# EAGLE design os33_master (EAGLE 9.6.2)
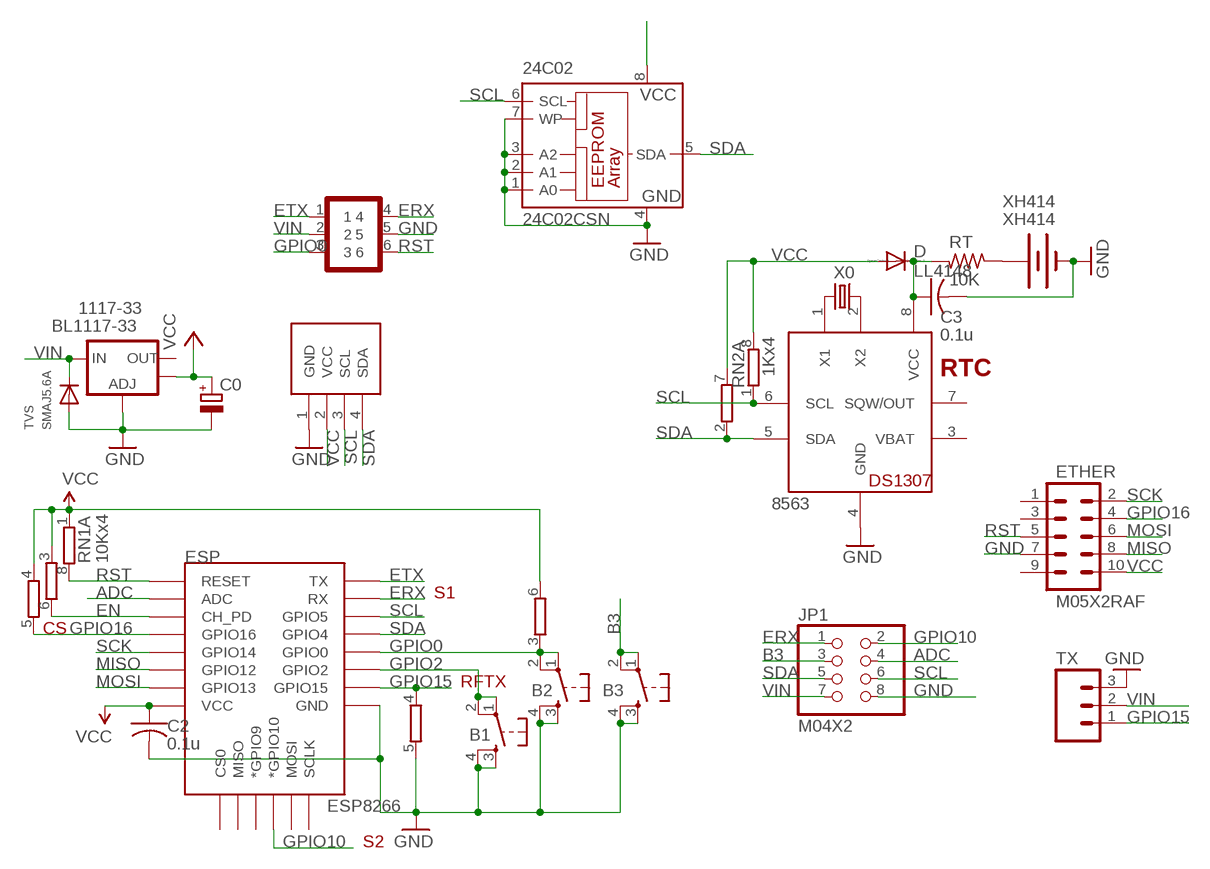
[diagram p0: schematic, sheet 1]

## Parts
24C02  24C02CSN  [SO-08]
1117-33  BL1117-33  V_REG_LM1117SOT223  [SOT223]
8563  PCF8563  DS1307SOIC  [SO08]
B1  SPST_TACTEVQQ2  [EVQ-Q2]
B2  SPST_TACTEVQQ2  [EVQ-Q2]
B3  SPST_TACTEVQQ2  [EVQ-Q2]
C0  CPOL-EUC  [PANASONIC_C]
C2  0.1u  C-USC0603  [C0603]
C3  0.1u  C-USC0603  [C0603]
D  LL4148  DIODE-MINIMELF  [MINIMELF]
ESP  ESP8266  ESP12ESMD  [ESP12E-SMD]
ETHER  M05X2RAF  [2X5-RAF]
JP1  M04X2  PINHD-2X4  [2X04]
LCD  SSD1306_OLED_I2CPCB0.75BB  [SSD1306_OLED_I2C_PCB_0.75BB]
RN1  10Kx4  4R-NEXB38V  [EXB38V]
RN2  1Kx4  4R-NEXB38V  [EXB38V]
RT  10K  R-US_R0603  [R0603]
TVS  SMAJ5.6A  DIODESMA  [SMADIODE]
TX  M03LOCK  [1X03_LOCK]
U$3  GOLDFINGER_2X3  [GOLDFINGER_2X3]
X0  32.768kHz  CRYSTALTC26H  [TC26H]
XH414  XH414  BATTERYXH414  [BATTCON_XH414]

## Nets
ADC [adc]: ESP.ADC JP1.4
B3: B3.1 B3.2 JP1.3
EN: ESP.CH_PD RN1.6
ERX: ESP.RXD0(RX) JP1.1 U$3.4
ETX: ESP.TXD0(TX) U$3.1
GND: 24C02.1(A0) 24C02.2(A1) 24C02.3(A2) 24C02.4(GND) 24C02.7(WP) 1117-33.1(ADJ) 8563.4(GND) B1.3 B1.4 B2.3 B2.4 B3.3 B3.4 C0.- C2.2 C3.2 ESP.GND ETHER.7 JP1.8 LCD.1(GND) RN2.5 TVS.A TX.3 U$3.5 XH414.P$1(-)
GPIO0: B2.1 B2.2 ESP.GPIO0 RN2.3 U$3.3
GPIO2: B1.1 B1.2 ESP.GPIO2
GPIO10: ESP.GPIO10(*GPIO10) JP1.2
GPIO15: ESP.GPIO15 RN2.4 TX.1
GPIO16: ESP.GPIO16 ETHER.4 RN1.5
MISO: ESP.GPIO12 ETHER.8
MOSI: ESP.GPIO13 ETHER.6
N$1: 8563.1(X1) X0.2
N$2: 8563.2(X2) X0.1
N$11: 8563.8(VCC) C3.1 D.C RT.2
N$36: RT.1 XH414.P$2(+)
RST: ESP.RESET ETHER.5 RN1.8 U$3.6
SCK: ESP.GPIO14 ETHER.2
SCL [I2C]: 24C02.6(SCL) 8563.6(SCL) ESP.GPIO5 JP1.6 LCD.3(SCL) RN2.1
SDA [I2C]: 24C02.5(SDA) 8563.5(SDA) ESP.GPIO4 JP1.5 LCD.4(SDA) RN2.2
VCC [vcc]: 24C02.8(VCC) 1117-33.4(OUT) C0.+ C2.1 D.A ESP.VCC ETHER.10 LCD.2(VCC) RN1.1 RN1.3 RN1.4 RN2.6 RN2.7 RN2.8
VIN [power]: 1117-33.3(IN) JP1.7 TVS.C TX.2 U$3.2
Unconnected: 1117-33.2(OUT) 8563.7(SQW/OUT) ESP.CS0 ESP.GPIO9(*GPIO9) ESP.MISO ESP.MOSI ESP.SCLK ETHER.1 ETHER.3 ETHER.9 RN1.2 RN1.7

## Notes on the sheet
- RTC
- S1
- CS
- RFTX
- S2

## Power pins joined to a net without a drawn wire
VBAT: 8563.3(VBAT)

## Library data of the parts
24C02 = microchip:24C*: Serial EEPROM 1 K/2 K/4 K; MF: MICROCHIP; MPN: 24C02C/SN; OC_FARNELL: 1607552; OC_NEWARK: 96K4065
1117-33 = SparkFun:V_REG_LM1117: Voltage Regulator LM1117 Standard adjustable voltage regulator but in SMD form. Spark Fun Electronics SKU : COM-00595
8563 = adafruit:DS1307: DS1307 Real time clock (RTC) with battery backup ability. Talk to it via i2c
B1-B3 = adafruit_3:SPST_TACT: SMT 6mm switch, EVQQ2 series http://www.ladyada.net/library/eagle
C0 = rcl:CPOL-EU: POLARIZED CAPACITOR, European symbol
C2 C3 = adafruit:C-US: CAPACITOR, American symbol
D = diode:DIODE-: DIODE
ESP = esp8266modules:ESP12E: ESP12E Module
ETHER = SparkFunNew:M05X2: Header 5x2 Standard 10-pin dual row 0.1" header. Commonly used with AVR-ISP. Use with Spark Fun Electronics SKU: PRT-00778
JP1 = pinhead:PINHD-2X4: PIN HEADER
LCD = adafruit2013:SSD1306_OLED_I2C
RN1 RN2 = resistor-dil:4R-N: Array Chip Resistor Source: RS Component / Phycomp; OC_FARNELL: unknown; OC_NEWARK: unknown
RT = adafruitGood:R-US_: RESISTOR, American symbol
TVS = adafruit:DIODE: Diode SMADIODE - SMA Surface Mount Package 20V 1A Schottky Diode Digikey: 641-1014-6-ND DO-1N4148 - Through Hole Small Current Diode SOD-123 20V 1 A (.5mV Vf) Schottky Diode - Digikey: MBRX120TPMSCT-ND SOD-323 10V 570mA (.38mV Vf, 3ns) Schottky Diode - Digikey: ZLLS410CT-ND SOD-523 30V 30mA Schottky Diode (RB751S-40TE61) - Digikey: RB751S-40TE61CT-ND SOT23-R/W - SOT23 Package (R = Solder Paste/Reflow Ovens, W = Hand-Soldering) BAT54Film 40V 300mA - Digikey: 497-7162-1-ND
TX = SparkFun:M03: Header 3 Standard 3-pin 0.1" header. Use with straight break away headers (SKU : PRT-00116), right angle break away headers (PRT-00553), swiss pins (PRT-00743), machine pins (PRT-00117), and female headers (PRT-00115). Molex polarized connector foot print use with SKU : PRT-08232 with associated crimp pins and housings.
U$3 = SparkFunNew:GOLDFINGER_2X3
X0 = crystal:CRYSTAL: CRYSTAL; OC_FARNELL: unknown; OC_NEWARK: unknown
XH414 = SparkFunNew:BATTERY: Battery Holders Various common sizes : AA, AAA, 20mm coin cell and 12mm coin cell.

## Net classes
0 default: width 0.254 mm, clearance 0.203 mm
1 power: width 0.406 mm, clearance 0.203 mm
2 relaypower: width 0.254 mm, clearance 0.203 mm
3 signal: width 0.254 mm, clearance 0.203 mm
4 adc: width 0.406 mm, clearance 0.203 mm
5 vcc: width 0.305 mm, clearance 0.203 mm
6 I2C: width 0.254 mm, clearance 0.203 mm

## Board
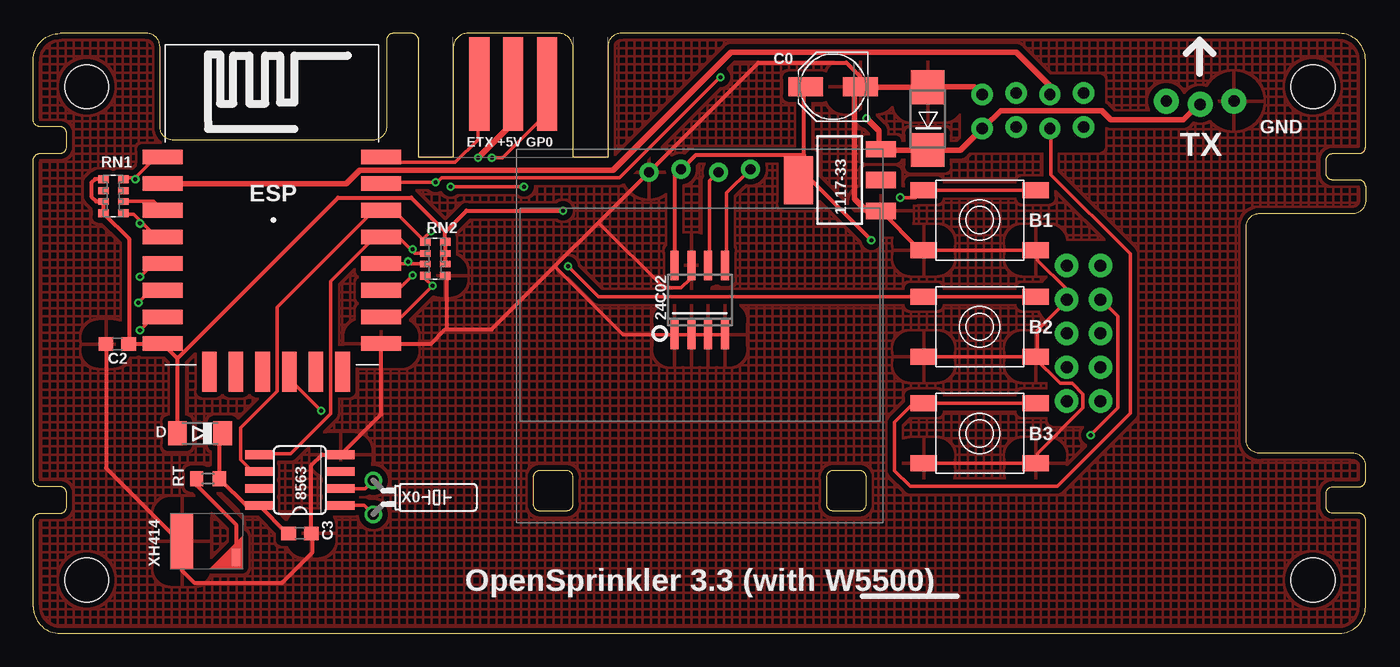
[diagram p1: board, top side]
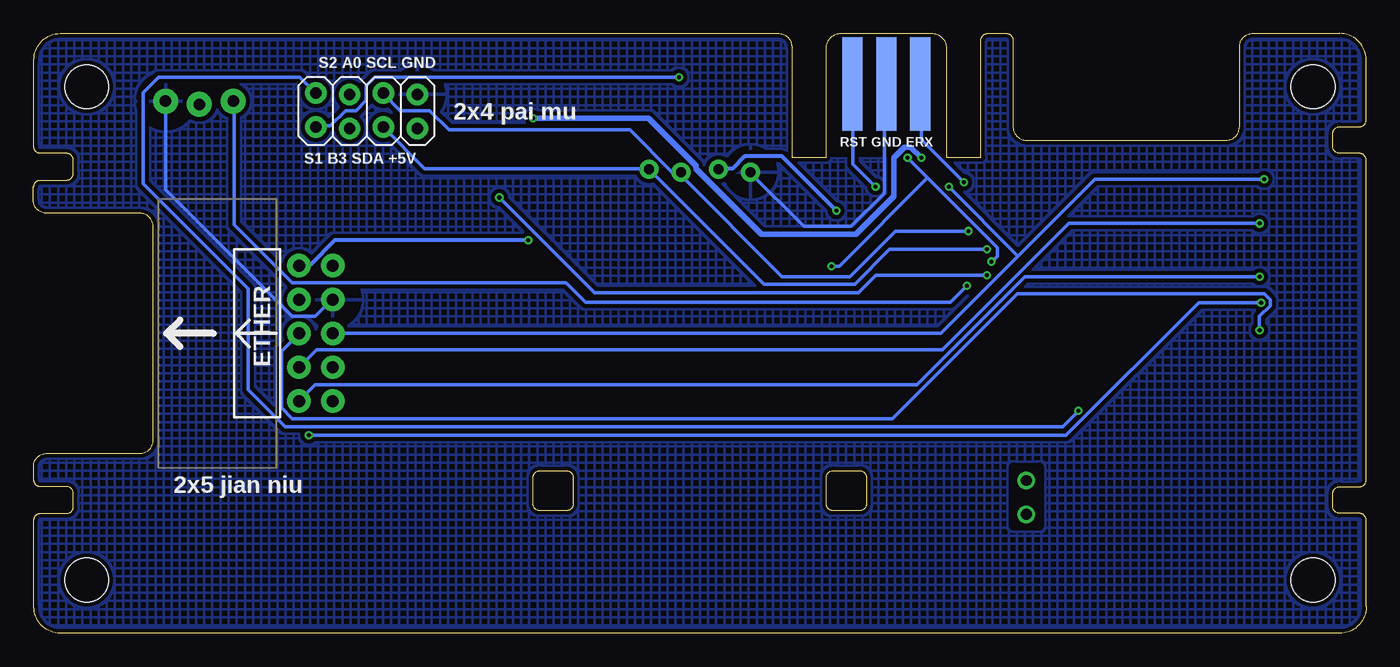
[diagram p2: board, bottom side, seen from below]

Size 100 x 45 mm. Coordinates in mm from the lower left corner, seen from the top.
Outline: 2,0 98,0 arc90 99.95,2 99.95,8.5 arc90 99.5,9 97.5,9 arc-90 97,9.5 97,10.5 arc-90 97.5,11 99.5,11 arc90 99.95,11.5 99.99,12.49 arc91 98.99,13.5 92,13.5 arc-90 91,14.5 91,30.5 arc-90 92,31.5 99,31.5 arc90 100,32.5 100,33.5 99.95,33.5 arc90 99.5,34 97.5,34 arc-90 97,34.5 97,35.5 arc-90 97.5,36 99.5,36 arc90 99.95,36.5 99.95,43 arc90 98,45 44.1,45 arc90 43.1,44 43.1,35.7 40.5,35.7 40.5,44 arc90 39.3,45 32.7,45 arc90 31.5,44 31.5,35.7 28.9,35.7 28.9,44.5 arc90 28.4,45 27,45 arc90 26.5,44.5 26.5,38 arc-90 25.5,37 10.5,37 arc-90 9.5,38 9.5,44 arc90 8.5,45 2,45 arc90 0,43 0,38.5 arc90 0.5,38 2,38 arc-90 2.5,37.5 2.5,36.5 arc-90 2,36 0.5,36 arc90 0,35.5 0,11.5 arc90 0.5,11 2,11 arc-90 2.5,10.5 2.5,9.5 arc-90 2,9 0.5,9 arc90 0,8.5 0,2 arc90 2,0
Copper layers (1*16): Top 0.035mm / dielectric 1.5mm / Bottom 0.035mm
Design rules "Fusion_eagle_rule_v1.1 *": minimum track width 6mil, minimum drill 12mil, track to track 6mil, track to pad 6mil, pad to pad 6mil, via to via 6mil, smd to smd 0mil, copper to edge 10mil, drill to drill 10mil, minimum pad ring 10mil, minimum via ring 6mil, stop-mask expansion 2mil, vias tented up to drill 100mil, thermal gap 50mil
Holes 3.3 mm at 4,4 96,4 4,41 96,41
tRestrict: area 70,36.5 to 80,41.5; area 31.5,36 to 40.5,45; area 76.5,16 to 81,29
bRestrict: area 24.5,8 to 26.5,12.5; area 31.5,36 to 40.5,45
vRestrict: area 11,20.5 to 25,36.5

### Footprints (pad centres in the part's own frame; a part is rotated, then mirrored left to right if it is on the bottom)
SO-08 = smd 0.6 x 2.2: 1 -1.905,-2.6; 2 -0.635,-2.6; 3 0.635,-2.6; 4 1.905,-2.6; 5 1.905,2.6; 6 0.635,2.6; 7 -0.635,2.6; 8 -1.905,2.6
SOT223 = smd 1.219 x 2.235: 1 -2.311,-3.099; 2 0,-3.099; 3 2.311,-3.099 | smd 3.6 x 2.2: 4 0,3.099
SO08 = smd 0.66 x 2.032: 1 -1.905,-3.073; 2 -0.635,-3.073; 3 0.635,-3.073; 4 1.905,-3.073; 5 1.905,3.073; 6 0.635,3.073; 7 -0.635,3.073; 8 -1.905,3.073
EVQ-Q2 = smd 2 x 1.2: 1 -4.2,-2.25; 2 4.2,-2.25; 3 -4.2,2.25; 4 4.2,2.25
PANASONIC_C = smd 2.6 x 1.4: + 2.05,0; - -2.05,0
C0603 = smd 1.1 x 1: 1 -0.85,0; 2 0.85,0
MINIMELF = smd 1.4 x 1.8: A 1.7,0; C -1.7,0
ESP12E-SMD = smd 3 x 1.1: ADC -8.3,2.73; CH_PD -8.3,0.73; GND 8.1,-9.27; GPIO0 8.1,-3.27; GPIO2 8.1,-5.27; GPIO4 8.1,-1.27; GPIO5 8.1,0.73; GPIO12 -8.3,-5.27; GPIO13 -8.3,-7.27; GPIO14 -8.3,-3.27; GPIO15 8.1,-7.27; GPIO16 -8.3,-1.27; RESET -8.3,4.73; RXD0 8.1,2.73; TXD0 8.1,4.73; VCC -8.3,-9.27 | smd 1.1 x 3: CS0 -4.8,-11.37; GPIO9 -0.8,-11.37; GPIO10 1.2,-11.37; MISO -2.8,-11.37; MOSI 3.2,-11.37; SCLK 5.2,-11.37
2X5-RAF = drill 0.9 pad 1.75: 1 5.08,1.27; 2 5.08,-1.27; 3 2.54,1.27; 4 2.54,-1.27; 5 0,1.27; 6 0,-1.27; 7 -2.54,1.27; 8 -2.54,-1.27; 9 -5.08,1.27; 10 -5.08,-1.27
2X04 = drill 0.85 pad 1.6: 1 -3.81,-1.219; 2 -3.81,1.321; 3 -1.27,-1.321; 4 -1.27,1.219; 5 1.27,-1.219; 6 1.27,1.321; 7 3.81,-1.321; 8 3.81,1.219
SSD1306_OLED_I2C_PCB_0.75BB = drill 0.75 pad 1.422: 1 -3.81,-0.1; 2 -1.42,0.1; 3 1.42,-0.1; 4 3.81,0.1
EXB38V = smd 0.6 x 0.8: 1 -1.275,-0.75; 4 1.275,-0.75; 5 1.275,0.75; 8 -1.275,0.75 | smd 0.5 x 0.8: 2 -0.4,-0.75; 3 0.4,-0.75; 6 0.4,0.75; 7 -0.4,0.75
R0603 = smd 1 x 1.1: 1 -0.85,0; 2 0.85,0
SMADIODE = smd 2.54 x 2.54: A 2.349,0; C -2.349,0
1X03_LOCK = drill 0.85 pad 1.88: 1 0,0.127; 2 2.54,-0.127; 3 5.08,0.127
GOLDFINGER_2X3 = smd 1.524 x 7: 1 -2.54,-3.5; 2 0,-3.5; 3 2.54,-3.5 | smd 1.524 x 7 bottom: 4 -2.54,-3.5; 5 0,-3.5; 6 2.54,-3.5
TC26H = drill 0.813: 1 -1.27,0; 2 1.27,0
BATTCON_XH414 = smd 4.1 x 1.7: P$1 0,-1.85 | smd 1.27 x 0.635: P$2 1.2,2.2

### Placement (x,y rotation side)
24C02  50,25 0 top
1117-33  60.5,34 90 top
8563  20,11.5 90 top
B1  71,31 180 top
B2  71,23 180 top
B3  71,15 180 top
C0  60,41 180 top
C2  6.3,21.7 180 top
C3  20,7.5 0 top
D  12.5,15 180 top
ESP  18,31 0 top
ETHER  78.8,22.5 270 bottom
JP1  75,39.2 0 bottom
LCD  50,34.7 0 top
RN1  6,32.8 270 top
RN2  30.15,28.1 270 top
RT  13.1,11.6 0 top
TVS  67.1,38.6 90 top
TX  85,39.8 0 top
U$3  36,44.7 0 top
X0  25.5,10.2 270 top
XH414  13,6.9 270 top

### Tracks (layer width: path | path; a pad name or v marks a point on that pad's centre or on a via)
ADC
  Top 0.406: ESP.ADC 23.48,33.73 24.48,34.74 43.48,34.74 52.35,43.6 73.74,43.6 76.27,41.07 JP1.4
B3
  Top 0.254: B3.1 B3.2 66.04,17.25 64.61,15.82 64.61,12.2 65.79,11.02 76.82,11.02 82.29,16.5 82.29,28.47 76.35,34.4 76.35,37.83 JP1.3
EN
  Top 0.254: RN1.6 9.03,32.4 ESP.CH_PD
ERX  (via drill 0.3)
  Top 0.254: ESP.RXD0 26.18,33.83 v30.18,33.83 30.29,33.83 30.63,34.18 43.98,34.18 51.52,41.72 v51.55,41.72
  Bottom 0.254: v30.18,33.83 33.38,37.03 33.38,41.15 U$3.4 | v51.55,41.72 74.38,41.72 75.02,41.08 75.02,39.97 75.78,39.2 76.58,39.2 77.72,38.06 78.75,38.06 JP1.1
ETX
  Top 0.254: ESP.TXD0 26.18,35.66 27.2,35.66 27.54,35.32 31.66,35.32 33.38,37.03 33.38,41.15 U$3.1
GND
  Top 0.254: B1.4 B1.3 75.32,28.69 75.32,28 77.5,25.83 77.5,25.15 ETHER.7 77.5,24.92 75.32,22.75 75.32,20.8 B2.3 | B2.4 B2.3 | B3.4 B3.3 75.32,12.8 75.32,13.49 78.75,16.92 78.75,17.95 77.95,18.75 77.04,18.75 75.09,20.69 B2.3 | 24C02.4 51.89,22.4 50.75,22.4 24C02.3 49.49,22.4 24C02.2 49.26,22.4 48.12,22.4 24C02.1 48.01,22.4 44.23,22.4 39.11,27.52 | 42.41,30.82 47.31,25.91 48.6,25.91 49.26,26.57 49.26,27.55 24C02.7
  Top 0.305: RN2.5 31,26.73 31,22.8 | XH414.P$1 11.15,6.7 | 11.15,6.7 11.15,4.7 12.05,3.8 18.65,3.8 20.95,6.1 20.95,7.4 C3.2 20.85,12.6 21.66,13.4 8563.4 26.1,16.43 ESP.GND 29.83,21.73 30.9,22.8 31,22.8 | C2.2 5.45,12.4 11.15,6.7 | 31,22.8 34.39,22.8 39.11,27.52 42.41,30.82 LCD.1 54.39,42.8 61,42.8 62.05,41.75 C0.- | B1.4 66.54,28.75 1117-33.1
  Top 0.406: JP1.8 70.61,41 67.15,41 TVS.A 62.05,40.95 62.02,40.98 | 1117-33.1 62.51,31.69 61.6,32.6 61.6,40.55 62.02,40.98 | 62.02,40.98 C0.-
  Bottom 0.254: U$3.5 36.15,39.41 36.15,33.01 38.65,30.52 42.18,30.52 46.18,34.52 LCD.1 | TX.3 90.07,39.89 90.07,33.26 80.58,23.77 78.87,23.77 77.61,25.03 ETHER.7
  pour Top (isolate 0.406, hatched): 0,45 100,45 100,0 0,0
  pour Bottom (isolate 0.305, hatched): 0,45 100,45 100,0 0,0
GPIO0  (via drill 0.3)
  Top 0.254: ESP.GPIO0 28.12,27.73 | 28.12,27.73 29.37,27.73 RN2.3 | B2.1 B2.2 66.64,25.26 42.41,25.26 v40.12,27.55 | v28.12,27.89 28.12,27.73 | v34.4,35.66 35.2,35.66 38.52,38.98 38.52,41.15 U$3.3
  Bottom 0.254: v28.12,27.89 28.06,27.89 27.68,28.27 27.68,28.93 32.9,34.16 | v34.4,35.66 32.9,34.16 | 32.9,34.16 39.52,27.55 v40.12,27.55
GPIO2  (via drill 0.3)
  Top 0.254: B1.1 B1.2 66.64,33.15 66.18,32.69 v65.04,32.69 | v28.46,26.86 27.43,25.83 26.18,25.83 ESP.GPIO2
  Bottom 0.254: v28.46,26.86 36.77,26.86 38.08,25.55 57.89,25.55 v65.04,32.69
GPIO10  (via drill 0.3)
  Top 0.254: v21.6,16.69 19.2,19.09 19.2,19.55 ESP.GPIO10
  Bottom 0.254: v21.6,16.69 21.6,16.65 22.74,15.52 81.1,15.52 83.88,18.29 83.88,25.86 91.74,33.73 91.74,40.56 90.59,41.71 80,41.71 78.87,40.58 JP1.2
GPIO15  (via drill 0.3)
  Top 0.254: ESP.GPIO15 27.62,23.73 v29.95,26.06 29.4,26.61 RN2.4
  Bottom 0.254: v29.95,26.06 31.18,24.83 58.56,24.83 60.02,26.29 80.58,26.29 84.92,30.63 84.92,39.89 TX.1
GPIO16  (via drill 0.3)
  Top 0.254: 8.17,30.8 9.14,29.83 9.6,29.83 ESP.GPIO16 | 8.17,30.8 7.54,31.43 6.86,31.43 RN1.5 | v8,30.75 8.12,30.75 8.17,30.8
  Bottom 0.254: v8,30.75 22.29,30.75 31.77,21.26 78.75,21.26 80.01,20 ETHER.4
MISO  (via drill 0.3)
  Top 0.254: v7.89,24.8 8.8,25.72 9.6,25.72 ESP.GPIO12 | v79.32,14.86 81.38,16.92 81.38,23.77 80.12,25.03 ETHER.8
  Bottom 0.254: v7.89,24.8 12.57,24.8 22.52,14.86 v79.32,14.86
MOSI  (via drill 0.3)
  Top 0.254: v8,22.75 8.91,23.66 9.6,23.66 ESP.GPIO13
  Bottom 0.254: v8,22.75 8,23.77 7.2,24.57 7.2,25.03 7.66,25.49 26.18,25.49 35.55,16.12 80.58,16.12 81.38,16.92 81.38,21.14 80.12,22.4 ETHER.6
N$1
  Top 0.254: 8563.1 24.84,9.6 X0.2
N$2
  Top 0.254: 8563.2 24.89,10.87 X0.1
N$11
  Top 0.305: D.C 13.95,14.75 RT.2 15.96,9.6 8563.8 19.02,7.5 C3.1
N$36
  Top 0.305: RT.1 12.25,11.1 15.2,8.15 XH414.P$2
RST  (via drill 0.3)
  Top 0.254: 7.66,34.18 6.86,34.18 RN1.8 | 7.66,34.18 9.14,35.66 9.6,35.66 ESP.RESET | v7.66,34.06 7.66,34.18 | v31.32,33.49 v36.8,33.49
  Bottom 0.254: v7.66,34.06 20.34,34.06 26.12,28.29 | 26.12,28.29 31.89,22.52 77.5,22.52 ETHER.5 | v36.8,33.49 38.52,35.2 38.52,41.15 U$3.6 | 26.12,28.29 v31.32,33.49
SCK  (via drill 0.3)
  Top 0.254: v8,26.75 8.91,27.66 9.6,27.66 ESP.GPIO14
  Bottom 0.254: v8,26.75 25.6,26.75 33.72,18.63 78.87,18.63 80.01,17.49 ETHER.2
SCL  (via drill 0.3)
  Top 0.254: 8563.6 16.92,12.23 16.34,12.23 15.54,13.03 15.54,15.43 18.29,18.17 18.29,24.46 25.49,31.66 26.06,31.66 ESP.GPIO5 27.05,31.73 RN2.1 29.26,29.6 v29.83,30.18 | 24C02.6 50.75,27.66 50.75,33.95 51.32,34.52 LCD.3
  Bottom 0.254: JP1.6 73.72,40.46 72.47,39.2 70.27,39.2 68.82,37.76 55.24,37.76 52.12,34.63 51.44,34.63 LCD.3 51.42,34.37 43.81,26.76 38.74,26.76 35.33,30.18 v29.83,30.18
SDA  (via drill 0.3)
  Top 0.254: RN2.2 28.6,28.5 28.38,28.72 | 28.38,28.72 27.37,29.73 ESP.GPIO4 26.06,29.6 25.49,29.6 22.29,26.4 22.29,16.46 19.32,13.49 17.03,13.49 8563.5 | v28.46,28.8 28.38,28.72 | 24C02.5 52.01,27.66 52.01,33.03 53.72,34.75 LCD.4
  Bottom 0.254: JP1.5 73.72,37.95 70.64,34.86 53.84,34.86 LCD.4 53.72,34.75 45.18,26.2 38.36,26.2 35.76,28.8 v28.46,28.8
VCC  (via drill 0.3)
  Top 0.305: RN1.1 4.62,34.08 4.35,33.8 4.35,32.75 4.7,32.4 RN1.3 RN1.4 7.18,29.59 7.18,21.73 | C2.1 7.18,21.73 | 7.18,21.73 ESP.VCC 10.8,20.63 | 10.8,20.63 D.A | RN2.6 RN2.7 RN2.8 30.86,29.49 30.86,30.18 | 30.86,30.18 28.35,32.69 22.86,32.69 10.86,20.69 10.8,20.63 | v39.76,31.7 32.5,31.7 30.98,30.18 30.86,30.18 | 57.84,35.89 57.84,34.4 57.49,34.06 1117-33.4 57.95,34.4 v62.87,29.49 | 57.84,35.89 57.84,40.92 C0.+ | 57.84,35.89 49.72,35.89 48.69,34.86 LCD.2 48.46,34.75 48.12,34.4 48.12,27.66 24C02.8
  Bottom 0.305: v39.76,31.7 43.83,35.78 46.63,35.78 47.55,34.86 48.58,34.86 LCD.2 | v62.87,29.49 77.38,29.49 79.21,27.66 80.01,27.66 ETHER.10
VIN  (via drill 0.3)
  Top 0.406: 87.44,39.66 | 87.44,39.66 86.3,38.52 80.86,38.52 80.17,39.2 72.58,39.2 71.32,37.95 JP1.7 69.56,36.25 TVS.C 63.66,36.25 1117-33.3 63.55,36.46 63.46,36.55 63.46,37.69 v62.51,38.64 | 87.44,39.66 TX.2 | v33.38,35.66 35.89,38.18 35.89,41.15 U$3.2
  Bottom 0.406: v33.38,35.66 34.18,36.46 34.63,36.46 35.43,35.66 35.43,32.78 38.27,29.95 45.38,29.95 50.29,34.86 50.29,35.09 53.84,38.64 v62.51,38.64

### Text on the board
bPlace: 2x4 pai mu | 2x5 jian niu
tNames: GND | ETX +5V GP0 | XH414 | OpenSprinkler 3.3 (with W5500)
bNames: S2 A0 SCL GND | RST GND ERX | S1 B3 SDA +5V